# Altium schematic sheet CAN.SchDoc
size A4
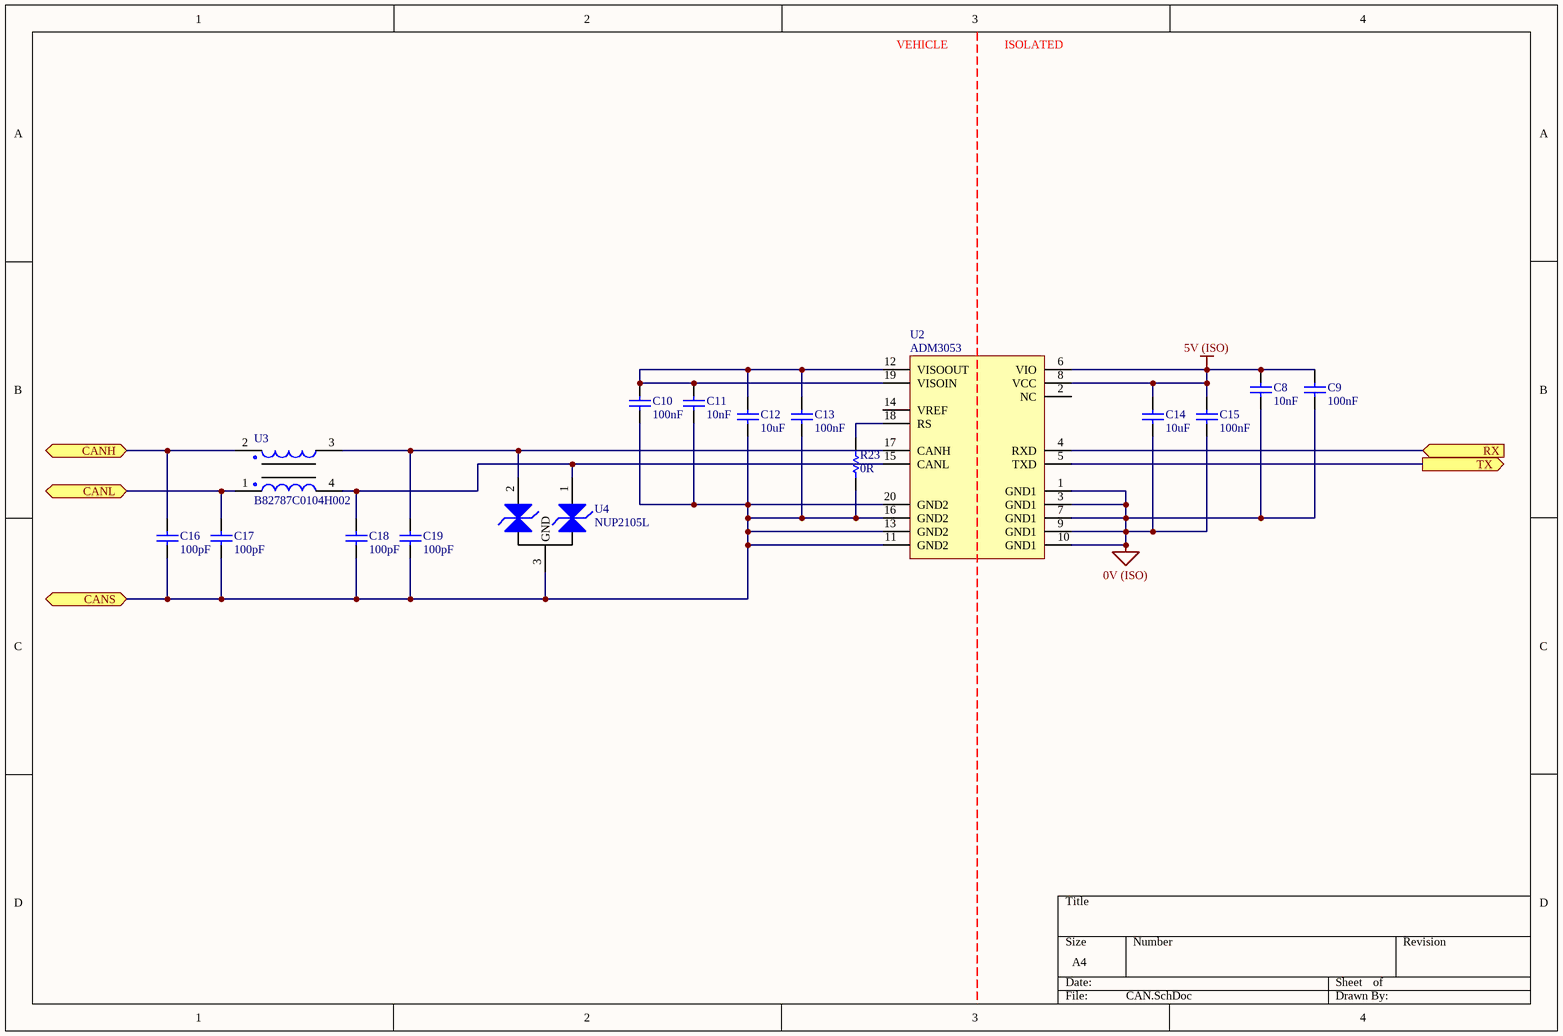
[diagram p0: CAN.SchDoc]

## Parts
C8  10nF  [1206]
C9  100nF  [0805]
C10  100nF  [0805]
C11  10nF  [1206]
C12  10uF  [0805]
C13  100nF  [0805]
C14  10uF  [0805]
C15  100nF  [0805]
C16  100pF  [0805]
C17  100pF  [0805]
C18  100pF  [0805]
C19  100pF  [0805]
R23  0R  [0805]
U2  ADM3053  [AD SOIC-W 20]
U3  B82787C0104H002  [TDK 4-PC Pad]
U4  NUP2105L  [ON SOT-23]

## Ports
CANH (bidir), CANL (bidir), CANS (bidir), RX (in), TX (out)

## Nets
0V (ISO): C8.1 C9.1 C14.1 C15.1 U2.1(GND1) U2.3(GND1) U2.7(GND1) U2.9(GND1) U2.10(GND1)
5V (ISO): C8.2 C9.2 C14.2 C15.2 U2.6(VIO) U2.8(VCC)
CANH: C16.2 U3.2 ; port CANH
CANL: C17.2 U3.1 ; port CANL
CANS: C10.1 C11.1 C12.1 C13.1 C16.1 C17.1 C18.1 C19.1 R23.1 U2.11(GND2) U2.13(GND2) U2.16(GND2) U2.20(GND2) U4.3(GND) ; port CANS
RX: U2.4(RXD) ; port RX
TX: U2.5(TXD) ; port TX
NetC10_2: C10.2 C11.2 C12.2 C13.2 U2.12(VISOOUT) U2.19(VISOIN)
NetC18_2: C18.2 U2.15(CANL) U3.4 U4.1(CAN_H)
NetC19_2: C19.2 U2.17(CANH) U3.3 U4.2(CAN_L)
NetR23_2: R23.2 U2.18(RS)

Not connected (* = marked no-connect by the designer): U2 2(NC) 14(VREF)

## Notes on the sheet
- VEHICLE
- ISOLATED

## Library data of the parts
C8 C11 = GCM3195C2A103JA16D: Manufacturer: muRata; Tolerance: 5%; Material: Ceramic; Rated Voltage: 100V; Part Number: GCM3195C2A103JA16D; Value: 10nF; Digikey Part Number: 490-4978-2-ND
C9 C10 C13 C15 = GCM21BR71E104KA37L: Manufacturer: muRata; Tolerance: 10%; Material: X7R; Rated Voltage: 25V; Part Number: GCM21BR71E104KA37L; Value: 100nF
C12 C14 = GRM21BR6YA106KE43L: Manufacturer: muRata; Tolerance: 10%; Material: X5R; Rated Voltage: 50V; Part Number: GRM21BR6YA106KE43L; Value: 10uF; Digikey Part Number: 490-10514-6-ND
C16-C19 = GCM21B5C1H101JA37L: Manufacturer: muRata; Tolerance: 5%; Material: C0G; Rated Voltage: 50V; Part Number: GCM21B5C1H101JA37L; Value: 100pF
R23 = RC0805FR070RL: Manufacturer: YAGEO; Tolerance: 0.01; Rated Voltage: 0.125W; Value: 0R; Part Number: RC0805FR070RL; Material: FR-07; qty: 50
U2 = ADM3053: Isolated CAN Transceiver; Manufacturer: Analogue Devices; Part Number: ADM3053; Digikey Part Number: ADM3053BRWZ-ND; Digikey Link: https://www.digikey.com/product-detail/en/analog-devices-inc/ADM3053BRWZ/ADM3053BRWZ-ND/2709332
U3 = B82787C0104H002: Common mode choke intended for CANBUS 150mA 50V); Manufacturer: EPCOS (TDK); Part Number: B82787C0104H002; Digikey Part Number: 495-4598-2-ND; Digikey Link: https://www.digikey.com/product-detail/en/epcos-tdk/B82787C0104H002/495-4598-2-ND/3680998
U4 = NUP2105L: Dual Line CAN Bus Protector; Manufacturer: ON Semiconductor; Part Number: NUP2105L; Digikey Part Number: NUP2105LT1GOSCT-ND; Digikey Link: https://www.digikey.com/product-detail/en/on-semiconductor/NUP2105LT1G/NUP2105LT1GOSCT-ND/1485001